# EAGLE design Mosquito (EAGLE 9.4.2)
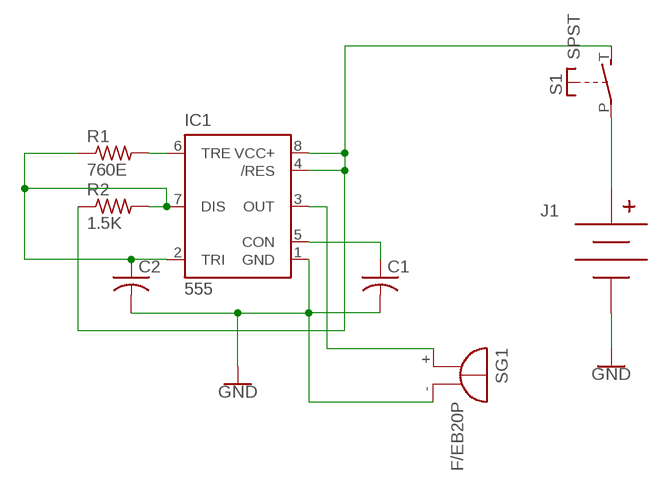
[diagram p0: schematic, sheet 1]

## Parts
C1  C-US025-024X044  [C025-024X044]
C2  C-US025-024X044  [C025-024X044]
IC1  555  555P  [DIP08]
J1  BC9VPC  [BC9VPC]
R1  760E  R-US_0204/2V  [0204V]
R2  1.5K  R-US_0204/2V  [0204V]
S1  SPST  [JUDCOSPST]
SG1  F/EB20P  [F/EB20P]

## Nets
GND: C1.2 C2.2 IC1.1(GND) J1.V- SG1.-
N$1: C2.1 IC1.2(TRI) IC1.7(DIS) R1.1 R2.2
N$2: IC1.6(TRE) R1.2
N$3: IC1.3(OUT) SG1.+
N$5: C1.1 IC1.5(CON)
N$7: J1.V+ S1.P
N$8: IC1.4(/RES) IC1.8(VCC+) R2.1 S1.T(S)

## Library data of the parts
C1 C2 = adafruit:C-US: CAPACITOR, American symbol
IC1 = SparkFun-IC-Special-Function:555: General purpose bipolar Timer Datasheet <http://www.sparkfun.com/datasheets/Components/General/ne555.pdf> SparkFun Products SparkFun SparkPunk Sequencer Kit <https://www.sparkfun.com/products/12707> (KIT-12707) Storefront Component: 555 Timer <https://www.sparkfun.com/products/9273> (COM-09273) Two parts valid for production: VFP: IC-11930 (M7555 PTH) VFP: IC-09173 (555 PTH) - Preferred; PROD_ID: IC-09173; PROD_ID_ALT: IC-09173
J1 = SparkFun-Connectors:BC9VPC: 9V Battery Holder - PC Mount Standard and Kit footprints included SparkFun Products: SparkFun SparkPunk Sound Kit <https://www.sparkfun.com/products/11177> SparkFun SparkPunk Sequencer Kit <https://www.sparkfun.com/products/12707>; PROD_ID: BATT-10855
R1 R2 = adafruit:R-US_: RESISTOR, American symbol
S1 = adafruit:SPST: Judco 50-0015-00
SG1 = buzzer:F/EB20P: BUZZER Source: Buerklin; OC_FARNELL: unknown; OC_NEWARK: unknown

## Board
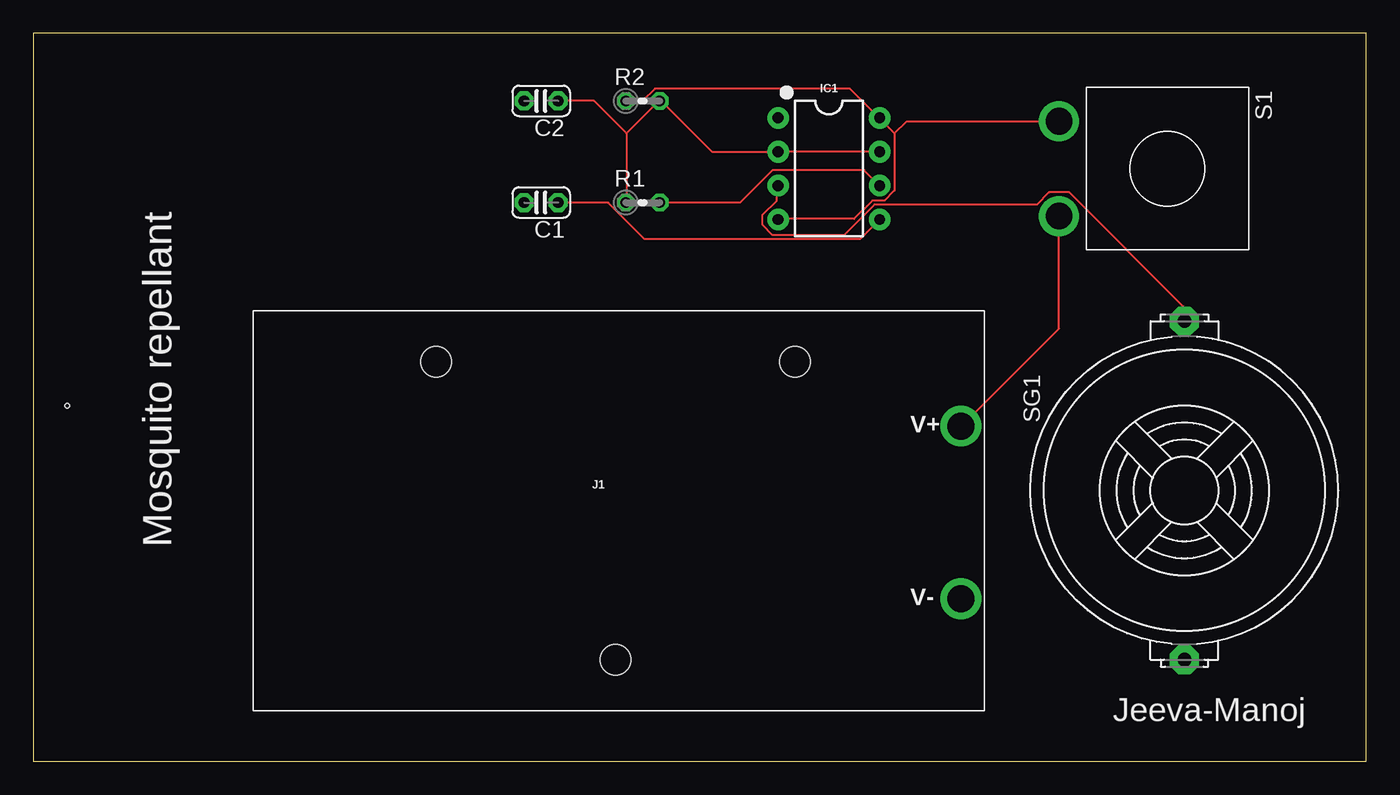
[diagram p1: board, top side]
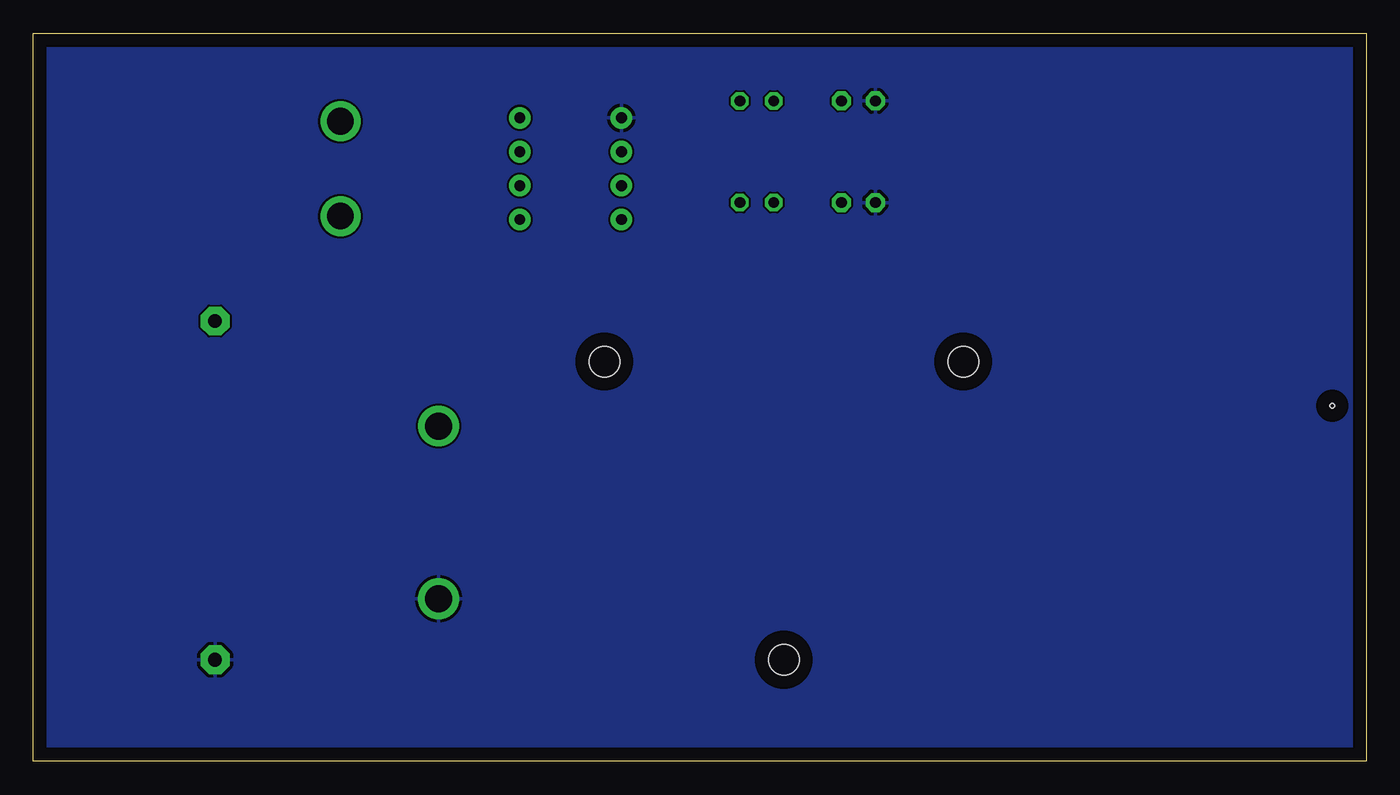
[diagram p2: board, bottom side, seen from below]

Size 100 x 54.6 mm. Coordinates in mm from the lower left corner, seen from the top.
Outline: 0,0 100,0 100,54.6 0,54.6 0,0
Copper layers (1*16): Top 0.035mm / dielectric 1.5mm / Bottom 0.035mm
Design rules "default": minimum track width 6mil, minimum drill 0.35mm, track to track 6mil, track to pad 6mil, pad to pad 6mil, via to via 6mil, smd to smd 6mil, copper to edge 40mil, drill to drill 6mil, minimum pad ring 10mil, minimum via ring 8mil, stop-mask expansion 4mil, vias tented up to drill 0mil, thermal gap 10mil
Holes 0.35 mm at 2.54,26.67

### Footprints (pad centres in the part's own frame; a part is rotated, then mirrored left to right if it is on the bottom)
C025-024X044 = drill 0.813 pad 1.422 octagon: 1 -1.27,0; 2 1.27,0
DIP08 = drill 0.813 pad 1.626: 1 -3.81,-3.81; 2 -1.27,-3.81; 3 1.27,-3.81; 4 3.81,-3.81; 5 3.81,3.81; 6 1.27,3.81; 7 -1.27,3.81; 8 -3.81,3.81
BC9VPC = drill 2.032: V+ 53.086,21.336; V- 53.086,8.382 | hole 2.286: 27.178,3.81; 13.716,26.162; 40.64,26.162
0204V = drill 0.813 octagon: 1 -1.27,0; 2 1.27,0
JUDCOSPST = drill 2: P 3.556,-8.128; T -3.556,-8.128
F/EB20P = drill 1.016 pad 2.159 octagon: + 12.7,0; - -12.7,0

### Placement (x,y rotation side)
C1  38.1,41.91 180 top
C2  38.1,49.53 180 top
IC1  59.69,44.45 270 top
J1  16.51,3.81 0 top
R1  45.72,41.91 0 top
R2  45.72,49.53 0 top
S1  85.09,44.45 270 top
SG1  86.36,20.32 90 top

### Tracks (layer width: path | path; a pad name or v marks a point on that pad's centre or on a via)
GND
  pour Bottom: -1.5,55.5 -1.5,-1.5 102,-1.5 102,57 -1.5,57
N$1
  Top 0.152: IC1.7 IC1.2 50.9,45.72 47.09,49.53 R2.2 46.94,49.53 44.5,47.09 | 44.5,47.09 44.5,41.91 R1.1 | C2.1 42.06,49.53 44.5,47.09
N$2
  Top 0.152: R1.2 53.03,41.91 55.47,44.35 62.33,44.35 IC1.6
N$3
  Top 0.152: IC1.3 55.78,43.13 55.78,42.06 54.71,41 54.71,40.23 55.47,39.47 60.81,39.47 63.09,41.76 75.29,41.76 76.2,42.67 77.72,42.67 86.26,34.14 86.26,33.07 SG1.+
N$5
  Top 0.152: C1.1 43.13,41.91 45.87,39.17 62.03,39.17 IC1.5
N$7
  Top 0.152: S1.P 76.96,32.46 69.65,25.15 J1.V+
N$8
  Top 0.152: R2.1 45.72,49.53 46.63,50.44 61.27,50.44 63.4,48.31 IC1.8 63.55,48.16 64.62,47.09 | 64.62,47.09 64.62,42.82 63.86,42.06 62.94,42.06 61.57,40.69 55.93,40.69 IC1.4 | S1.T 65.53,48.01 64.62,47.09

### Text on the board
tNames: Mosquito repellant | Jeeva-Manoj